# Altium schematic sheet FVA-NET.SchDoc
size A4
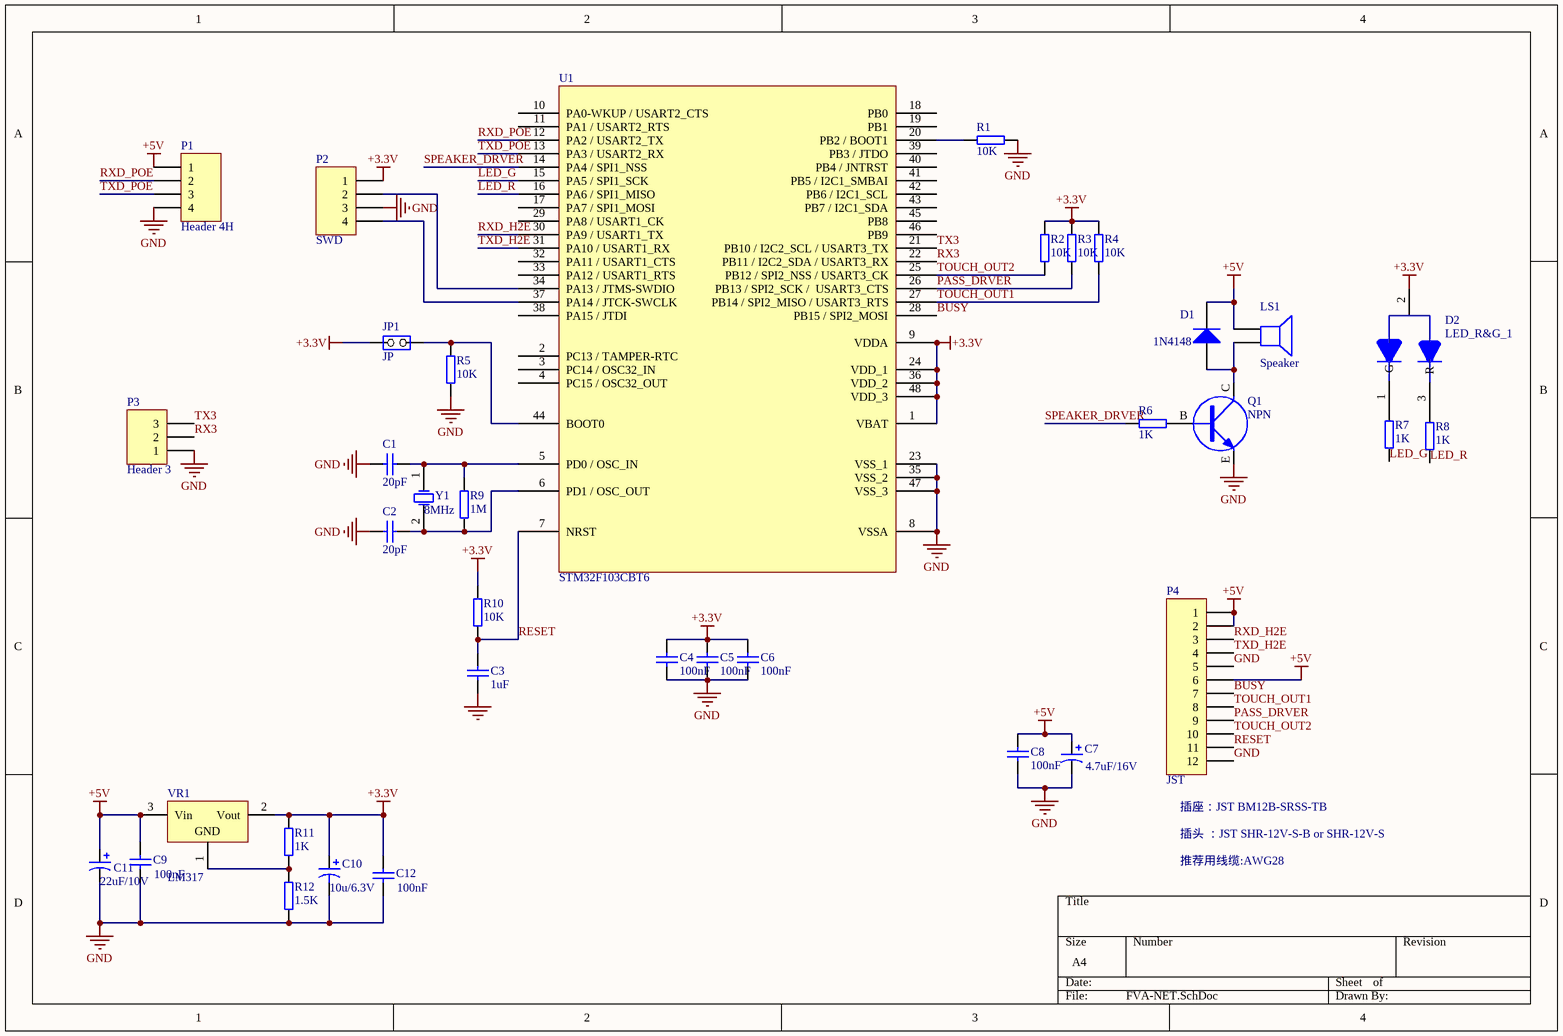
[diagram p0: FVA-NET.SchDoc]

## Parts
C1  value 20pF  [c0603]  (hidden comment: Cap)
C2  value 20pF  [c0603]  (hidden comment: Cap)
C3  value 1uF  [c0603]  (hidden comment: Cap)
C4  value 100nF  [c0603]  (hidden comment: Cap)
C5  value 100nF  [c0603]  (hidden comment: Cap)
C6  value 100nF  [c0603]  (hidden comment: Cap)
C7  value 4.7uF/16V  [T3216]  (hidden comment: CAP+)
C8  value 100nF  [C0603]  (hidden comment: CAP)
C9  value 100nF  [C0603]  (hidden comment: cap)
C10  value 10u/6.3V  [T3216]  (hidden comment: Cap Pol1)
C11  value 22uF/10V  [T3216]  (hidden comment: CAP+)
C12  value 100nF  [C0603]  (hidden comment: cap)
D1  1N4148  [D1206]
D2  LED_R&G_1  [LED_R&G]
JP1  JP  [SIP2]
LS1  Speaker  [BUZZER]
P1  Header 4H  [HDR1X4H]
P2  SWD  [HDR1X4]
P3  Header 3  [HDR1X3]
P4  JST  [JST BM12B-SRSS-TB]
Q1  NPN  [SOT23/BEC]
R1  value 10K  [R0603]  (hidden comment: RES)
R2  value 10K  [R0603]  (hidden comment: RES)
R3  value 10K  [R0603]  (hidden comment: RES)
R4  value 10K  [R0603]  (hidden comment: RES)
R5  value 10K  [R0603]  (hidden comment: RES)
R6  value 1K  [R0603]  (hidden comment: RES)
R7  value 1K  [R0603]  (hidden comment: RES)
R8  value 1K  [R0603]  (hidden comment: RES)
R9  value 1M  [R0603]  (hidden comment: RES)
R10  value 10K  [R0603]  (hidden comment: RES)
R11  value 1K  [R0603]  (hidden comment: RES)
R12  value 1.5K  [R0603]  (hidden comment: RES)
U1  STM32F103CBT6  [LQFP48]
VR1  LM317  [SOT223]
Y1  8MHz  [XTAL-HC-49/U-S]

## Nets
+3.3V: C4.2 C5.2 C6.2 C10.1 C12.2 D2.2(P) JP1.1(COMMON) P2.1 R2.2 R3.2 R4.2 R10.1 R11.2 U1.1(VBAT) U1.9(VDDA) U1.24(VDD_1) U1.36(VDD_2) U1.48(VDD_3) VR1.2(Vout)
+5V: C7.1 C8.2 C9.2 C11.1 D1.2(K) LS1.1 P1.1 P4.1 P4.2 P4.6 VR1.3(Vin)
GND: C1.1 C2.1 C3.1 C4.1 C5.1 C6.1 C7.2 C8.1 C9.1 C10.2 C11.2 C12.1 P1.4 P2.3 P3.1 P4.5 P4.12 Q1.E R1.1 R5.1 R12.1 U1.8(VSSA) U1.23(VSS_1) U1.35(VSS_2) U1.47(VSS_3)
BUSY: P4.7 U1.28(PB15_/_SPI2_MOSI)
LED_G: R7.2 U1.15(PA5_/_SPI1_SCK)
LED_R: R8.2 U1.16(PA6_/_SPI1_MISO)
PASS_DRVER: P4.9 R3.1 U1.26(PB13_/_SPI2_SCK_/__USART3_CTS)
RESET: C3.2 P4.11 R10.2 U1.7(NRST)
RX3: P3.2 U1.22(PB11_/_I2C2_SDA_/_USART3_RX)
RXD_H2E: P4.3 U1.30(PA9_/_USART1_TX)
RXD_POE: P1.2 U1.12(PA2_/_USART2_TX)
SPEAKER_DRVER: R6.2 U1.14(PA4_/_SPI1_NSS)
TOUCH_OUT1: P4.8 R4.1 U1.27(PB14_/_SPI2_MISO_/_USART3_RTS)
TOUCH_OUT2: P4.10 R2.1 U1.25(PB12_/_SPI2_NSS_/_USART3_CK)
TX3: P3.3 U1.21(PB10_/_I2C2_SCL_/_USART3_TX)
TXD_H2E: P4.4 U1.31(PA10_/_USART1_RX)
TXD_POE: P1.3 U1.13(PA3_/_USART2_RX)
NetC1_2: C1.2 R9.2 U1.5(PD0_/_OSC_IN) Y1.1(OSC1)
NetC2_2: C2.2 R9.1 U1.6(PD1_/_OSC_OUT) Y1.2(OSC2)
NetD1_1: D1.1(A) LS1.2 Q1.C
NetD2_1: D2.1(G) R7.1
NetD2_3: D2.3(R) R8.1
NetJP1_2: JP1.2(NO) R5.2 U1.44(BOOT0)
NetP2_2: P2.2 U1.34(PA13_/_JTMS-SWDIO)
NetP2_4: P2.4 U1.37(PA14_/_JTCK-SWCLK)
NetQ1_B: Q1.B R6.1
NetR1_2: R1.2 U1.20(PB2_/_BOOT1)
NetR11_1: R11.1 R12.2 VR1.1(GND)

Not connected (* = marked no-connect by the designer): U1 2(PC13_/_TAMPER-RTC) 3(PC14_/_OSC32_IN) 4(PC15_/_OSC32_OUT) 10(PA0-WKUP_/_USART2_CTS) 11(PA1_/_USART2_RTS) 17(PA7_/_SPI1_MOSI) 18(PB0) 19(PB1) 29(PA8_/_USART1_CK) 32(PA11_/_USART1_CTS) 33(PA12_/_USART1_RTS) 38(PA15_/_JTDI) 39(PB3_/_JTDO) 40(PB4_/_JNTRST) 41(PB5_/_I2C1_SMBAI) 42(PB6_/_I2C1_SCL) 43(PB7_/_I2C1_SDA) 45(PB8) 46(PB9)

## Notes on the sheet
- 插头 ：JST SHR-12V-S-B or SHR-12V-S
- (near P4) 插座：JST BM12B-SRSS-TB
- 推荐用线缆:AWG28

## Library data of the parts
C1-C6 = Cap: 电容器 Capacitor; Published: 8-Jun-2000; LatestRevisionDate: 17-Jul-2002; LatestRevisionNote: Re-released for DXP Platform.; PackageReference: RAD-0.3; Publisher: Altium Limited
C8 = CAP: Capacitor
C9 C12 = cap: Capacitor
C10 = Cap Pol1: Polarized Capacitor (Radial); Published: 8-Jun-2000; LatestRevisionDate: 17-Jul-2002; LatestRevisionNote: Re-released for DXP Platform.; Publisher: Altium Limited
D1 = Diode 1N4148: High Conductance Fast Diode; Value: 1N4148
JP1 = JP2: Value: *
LS1 = Speaker: Loudspeaker; Published: 24-Mar-1999; LatestRevisionDate: 17-Jul-2002; LatestRevisionNote: Re-released for DXP Platform.; PackageReference: PIN2; Publisher: Altium Limited
P1 = Header 4H: Header, 4-Pin, Right Angle; LatestRevisionDate: 17-Jul-2002; LatestRevisionNote: Re-released for DXP Platform.; Publisher: Altium Limited
P2 = Header 4: Header, 4-Pin; LatestRevisionDate: 17-Jul-2002; LatestRevisionNote: Re-released for DXP Platform.; Publisher: Altium Limited; Value: *
P3 = Header 3: Header, 3-Pin; LatestRevisionDate: 17-Jul-2002; LatestRevisionNote: Re-released for DXP Platform.; Publisher: Altium Limited
P4 = Header 12: Header, 12-Pin; LatestRevisionDate: 17-Jul-2002; LatestRevisionNote: Re-released for DXP Platform.; Publisher: Altium Limited
Q1 = NPN: NPN Transistor; Value: *
U1 = STM32F103x6x8xB: 48 pin; Value: *
VR1 = Volt Reg: Voltage Regulator; Published: 24-Mar-1999; LatestRevisionDate: 17-Jul-2002; LatestRevisionNote: Re-released for DXP Platform.; Publisher: Altium Limited; Code_JEDEC: SMD-220
Y1 = XTAL: Crystal Oscillator; Published: 8-Jun-2000; LatestRevisionDate: 17-Jul-2002; LatestRevisionNote: Re-released for DXP Platform.; PackageReference: R38; Publisher: Altium Limited; Value: 8MHz